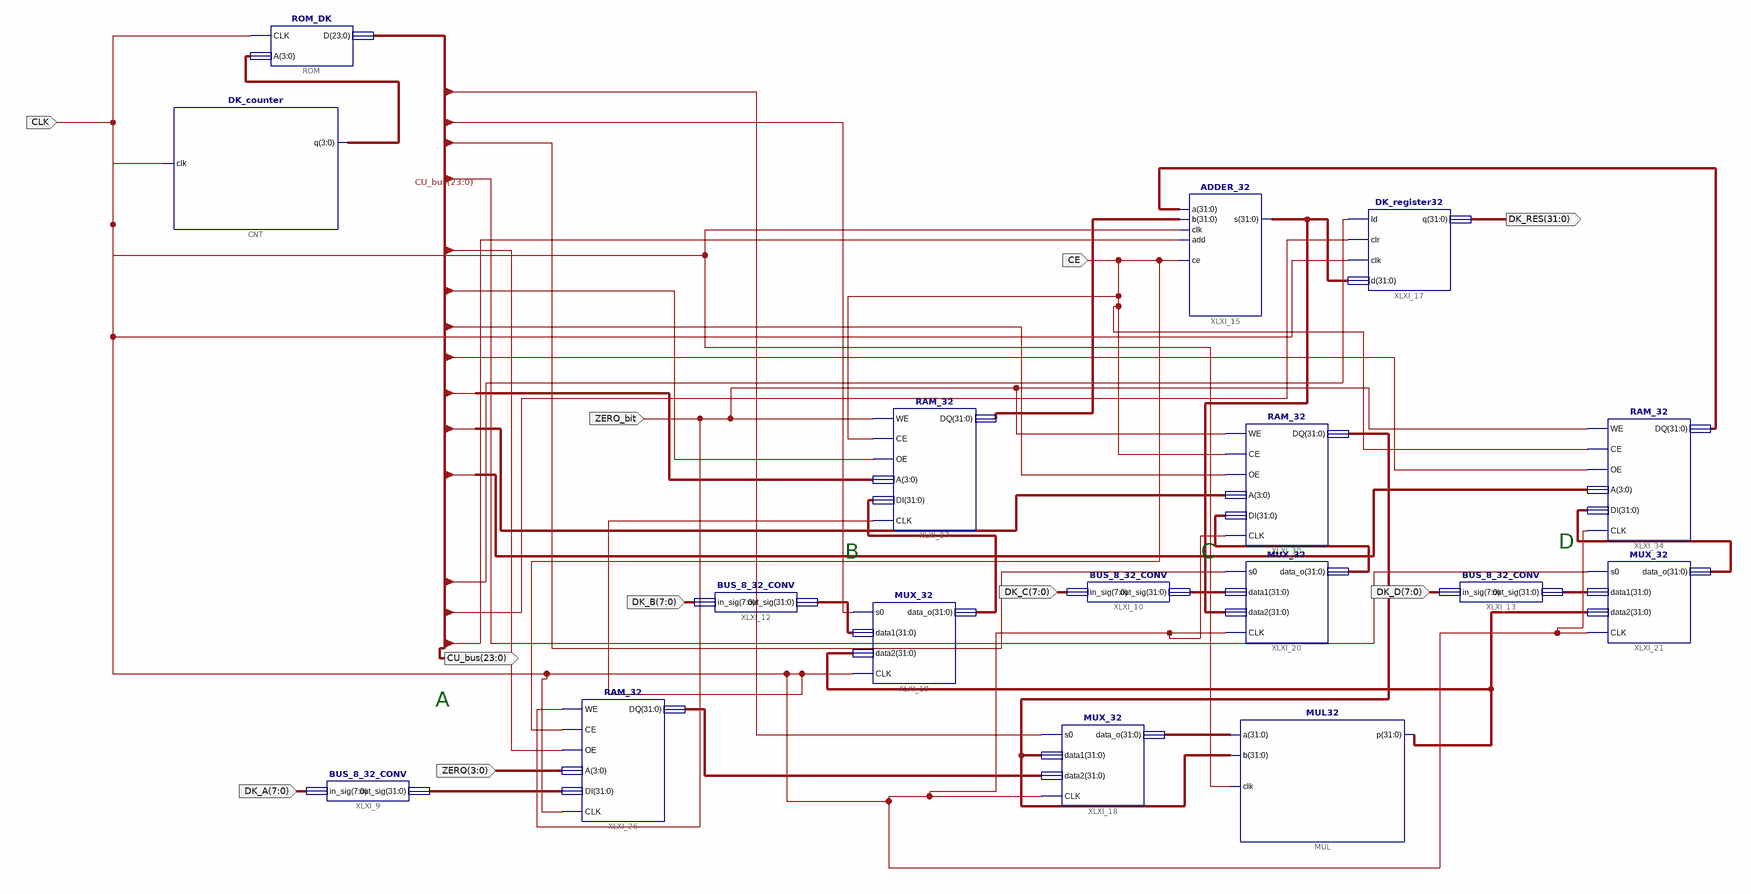
[diagram p0: schematic sheet 1]
// Xilinx ISE schematic DK_sch.sch (virtex7) as structural Verilog: 17 symbols, 10 ports
module DK_sch (
  input  [3:0] ZERO,
  input  ZERO_bit,
  input  CLK,
  input  [7:0] DK_D,
  input  [7:0] DK_C,
  input  [7:0] DK_B,
  input  [7:0] DK_A,
  input  CE,
  output [23:0] CU_bus,
  output [31:0] DK_RES
);

  wire [3:0] XLXN_90;
  wire [31:0] ADDER_OUT, MUL_OUT_RAM2_RAM4, MUX1_MUL_A, MUX2, MUX3, MUX4, RAM1, RAM2, RAM3_MUL_B, RAM4,
       XLXN_91, XLXN_92, XLXN_93, XLXN_94;

  MUL32 MUL (.a(MUX1_MUL_A), .b(RAM3_MUL_B), .clk(CLK), .p(MUL_OUT_RAM2_RAM4));
  DK_counter CNT (.clk(CLK), .q(XLXN_90));
  ROM_DK ROM (.CLK(CLK), .A(XLXN_90), .D(CU_bus));
  BUS_8_32_CONV XLXI_9 (.in_sig(DK_A), .out_sig(XLXN_91));
  BUS_8_32_CONV XLXI_10 (.in_sig(DK_C), .out_sig(XLXN_92));
  BUS_8_32_CONV XLXI_12 (.in_sig(DK_B), .out_sig(XLXN_93));
  BUS_8_32_CONV XLXI_13 (.in_sig(DK_D), .out_sig(XLXN_94));
  ADDER_32 XLXI_15 (.a(RAM4), .b(RAM2), .clk(CLK), .add(CU_bus[0]), .ce(CE), .s(ADDER_OUT));
  DK_register32 XLXI_17 (.ld(CU_bus[2]), .clr(CU_bus[1]), .clk(CLK), .d(ADDER_OUT), .q(DK_RES));
  MUX_32 XLXI_18 (.s0(CU_bus[23]), .CLK(CLK), .data1(RAM3_MUL_B), .data2(RAM1), .data_o(MUX1_MUL_A));
  MUX_32 XLXI_19 (.s0(CU_bus[22]), .CLK(CLK), .data1(XLXN_93), .data2(MUL_OUT_RAM2_RAM4), .data_o(MUX2));
  MUX_32 XLXI_20 (.s0(CU_bus[21]), .CLK(CLK), .data1(XLXN_92), .data2(ADDER_OUT), .data_o(MUX3));
  MUX_32 XLXI_21 (.s0(CU_bus[20]), .CLK(CLK), .data1(XLXN_94), .data2(MUL_OUT_RAM2_RAM4), .data_o(MUX4));
  RAM_32 XLXI_26 (.WE(ZERO_bit), .CE(CE), .OE(CU_bus[19]), .A(ZERO), .DI(XLXN_91), .DQ(RAM1), .CLK(CLK));
  RAM_32 XLXI_27 (.WE(ZERO_bit), .CE(CE), .OE(CU_bus[18]), .A(CU_bus[15:12]), .DI(MUX2), .DQ(RAM2), .CLK(CLK));
  RAM_32 XLXI_30 (.WE(ZERO_bit), .CE(CE), .OE(CU_bus[17]), .A(CU_bus[11:8]), .DI(MUX3), .DQ(RAM3_MUL_B), .CLK(CLK));
  RAM_32 XLXI_34 (.WE(ZERO_bit), .CE(CE), .OE(CU_bus[16]), .A(CU_bus[7:4]), .DI(MUX4), .DQ(RAM4), .CLK(CLK));

  // Notes on the sheet:
  //   D
  //   B
  //   C
  //   A
endmodule
